# EAGLE design DTUnodeSchematic (EAGLE 8.0.0)
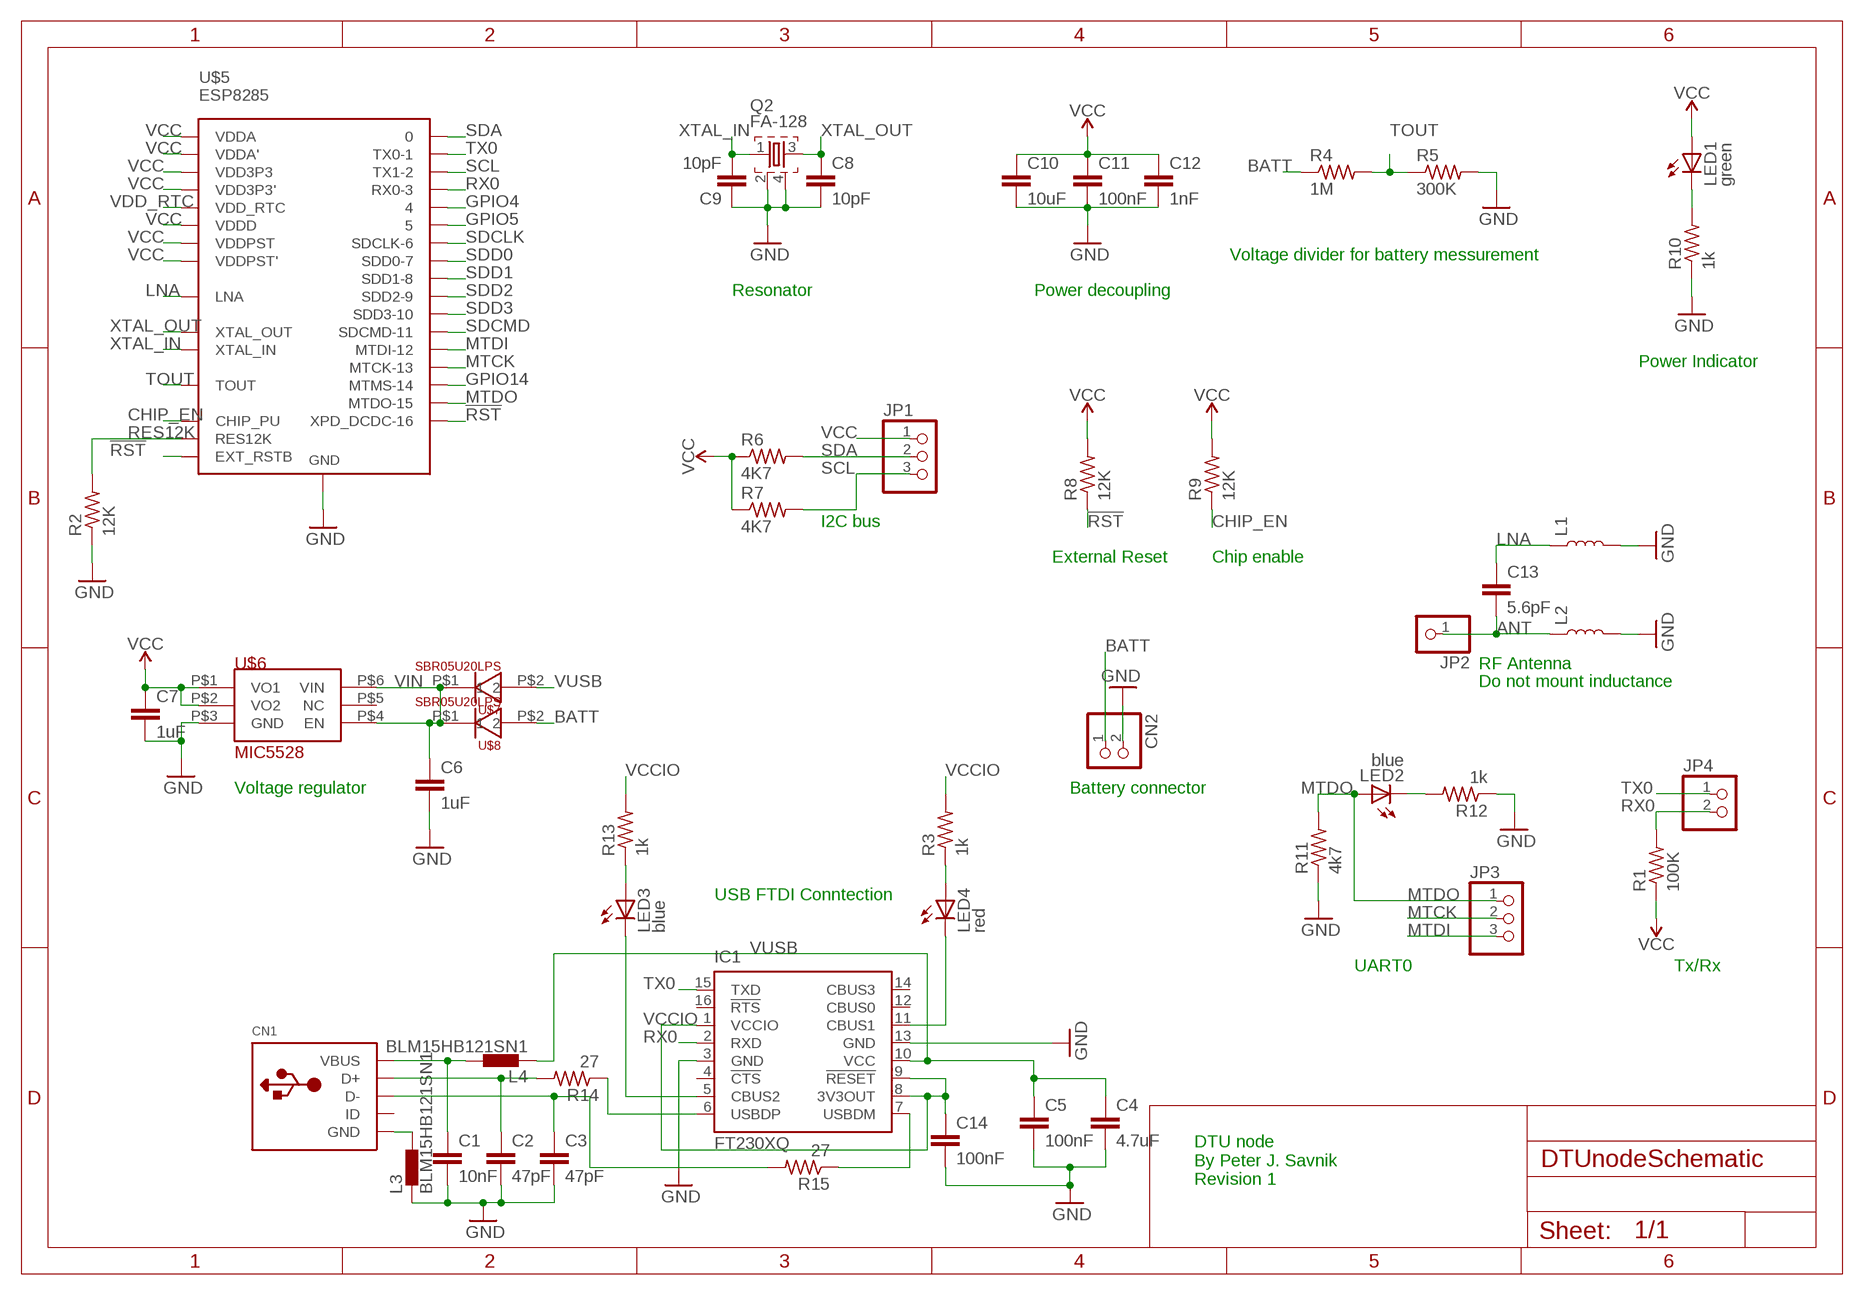
[diagram p0: schematic, sheet 1]

## Parts
C1  10nF  C-EUC0402K  [C0402K]
C2  47pF  C-EUC0402K  [C0402K]
C3  47pF  C-EUC0402K  [C0402K]
C4  4.7uF  C-EUC0402K  [C0402K]
C5  100nF  C-EUC0402K  [C0402K]
C6  1uF  C-EUC0402K  [C0402K]
C7  1uF  C-EUC0402K  [C0402K]
C8  10pF  C-EUC0402K  [C0402K]
C9  10pF  C-EUC0402K  [C0402K]
C10  10uF  C-EUC0402K  [C0402K]
C11  100nF  C-EUC0402K  [C0402K]
C12  1nF  C-EUC0402K  [C0402K]
C13  5.6pF  C-EUC0402K  [C0402K]
C14  100nF  C-EUC0402K  [C0402K]
CN1  USBMINIB  [USB-MINIB]
CN2  JST_2PIN-THM-RA  [JST-PH-2-THM-RA]
IC1  FT230XQ  [QFN16]
JP1  PINHD-1X3  [1X03]
JP2  PINHD-1X1  [1X01]
JP3  PINHD-1X3  [1X03]
JP4  PINHD-1X2  [1X02]
L1  INDUCTOR-0402-3.9NH  [0402]
L2  INDUCTOR-0402-3.9NH  [0402]
L3  BLM15HB121SN1  [0402]
L4  BLM15HB121SN1  [0402]
LED1  green  LEDCHIP-LED0603  [CHIP-LED0603]
LED2  blue  LEDCHIP-LED0603  [CHIP-LED0603]
LED3  blue  LEDCHIP-LED0603  [CHIP-LED0603]
LED4  red  LEDCHIP-LED0603  [CHIP-LED0603]
Q2  FA-128  [FA-128]
R1  100K  R-US_R0402  [R0402]
R2  12K  R-US_R0402  [R0402]
R3  1k  R-US_R0402  [R0402]
R4  1M  R-US_R0402  [R0402]
R5  300K  R-US_R0402  [R0402]
R6  4K7  R-US_R0402  [R0402]
R7  4K7  R-US_R0402  [R0402]
R8  12K  R-US_R0402  [R0402]
R9  12K  R-US_R0402  [R0402]
R10  1k  R-US_R0402  [R0402]
R11  4k7  R-US_R0402  [R0402]
R12  1k  R-US_R0402  [R0402]
R13  1k  R-US_R0402  [R0402]
R14  27  R-US_R0402  [R0402]
R15  27  R-US_R0402  [R0402]
U$5  ESP8285  [QFN-32]
U$6  MIC5528  [6-PIN_1.2MMX1.2MM_THIN_FDN(MT)]
U$7  SBR05U20LPS  [X2-DFN1006-2]
U$8  SBR05U20LPS  [X2-DFN1006-2]

## Nets
!RST: R8.1 U$5.P$8(XPD_DCDC-16) U$5.P$32(EXT_RSTB)
ANT: C13.2 JP2.1 L2.1
BATT: CN2.1 R4.1 U$8.P$2
CHIP_EN: R9.1 U$5.P$7(CHIP_PU)
GND: C1.2 C2.2 C3.2 C4.2 C5.2 C6.2 C7.2 C8.2 C9.1 C10.2 C11.2 C12.2 C14.2 CN2.2 IC1.3(GND) IC1.13(GND) L1.2 L2.2 L3.1 Q2.2 Q2.4 R2.1 R5.2 R10.1 R11.1 R12.1 U$5.33-GND(GND) U$6.P$3(GND)
GPIO4: U$5.P$16
GPIO5: U$5.P$24
GPIO14: U$5.P$9(MTMS-14)
LNA: C13.1 L1.1 U$5.P$2(LNA)
MTCK: JP3.2 U$5.P$12(MTCK-13)
MTDI: JP3.3 U$5.P$10(MTDI-12)
MTDO: JP3.1 LED2.A R11.2 U$5.P$13(MTDO-15)
N$1: CN1.GND L3.2
N$2: IC1.6(USBDP) R14.1
N$4: C1.1 CN1.VBUS L4.2
N$5: C2.1 CN1.D+ R14.2
N$6: LED1.C R10.2
N$7: C3.1 CN1.D- R15.2
N$8: LED2.C R12.2
N$9: IC1.7(USBDM) R15.1
N$16: LED3.A R13.1
N$17: LED4.A R3.1
N$18: IC1.5(CBUS2) LED3.C
N$19: IC1.11(CBUS1) LED4.C
RES12K: R2.2 U$5.P$31(RES12K)
RX0: IC1.2(RXD) JP4.2 R1.2 U$5.P$25(RX0-3)
SCL: JP1.3 R7.2 U$5.P$14(TX1-2)
SDA: JP1.2 R6.2 U$5.P$15
SDCLK: U$5.P$21(SDCLK-6)
SDCMD: U$5.P$20(SDCMD-11)
SDD0: U$5.P$22(SDD0-7)
SDD1: U$5.P$23(SDD1-8)
SDD2: U$5.P$18(SDD2-9)
SDD3: U$5.P$19(SDD3-10)
TOUT: R4.2 R5.1 U$5.P$6(TOUT)
TX0: IC1.15(TXD) JP4.1 U$5.P$26(TX0-1)
VCC: C7.1 C10.1 C11.1 C12.1 JP1.1 LED1.A R1.1 R6.1 R7.1 R8.2 R9.2 U$5.P$1(VDDA) U$5.P$3(VDD3P3) U$5.P$4(VDD3P3') U$5.P$11(VDDPST) U$5.P$17(VDDPST') U$5.P$29(VDDD) U$5.P$30(VDDA') U$6.P$1(VO1) U$6.P$2(VO2)
VCCIO: C14.1 IC1.1(VCCIO) IC1.8(3V3OUT) IC1.9(!RESET) R3.2 R13.2
VDD_RTC: U$5.P$5(VDD_RTC)
VIN: C6.1 U$6.P$4(EN) U$6.P$6(VIN) U$7.P$1 U$8.P$1
VUSB: C4.1 C5.1 IC1.10(VCC) L4.1 U$7.P$2
XTAL_IN: C9.2 Q2.1 U$5.P$28(XTAL_IN)
XTAL_OUT: C8.1 Q2.3 U$5.P$27(XTAL_OUT)
Unconnected: CN1.ID IC1.4(!CTS) IC1.12(CBUS0) IC1.14(CBUS3) IC1.16(!RTS) U$6.P$5(NC)

## Notes on the sheet
- Voltage divider for battery messurement
- Resonator | Power decoupling
- Power Indicator
- I2C bus
- External Reset | Chip enable
- RF Antenna
- Do not mount inductance
- Voltage regulator | Battery connector
- USB FTDI Conntection
- UART0 | Tx/Rx
- DTU node
  By Peter J. Savnik
  Revision 1

## Library data of the parts
C1 = resistor:C-EU: CAPACITOR, European symbol; MF: MULTICOMP; MPN: MC1206B103K102CT; OC_FARNELL: 1855902
C2-C14 = resistor:C-EU: CAPACITOR, European symbol; OC_FARNELL: unknown
CN1 = adafruit:USB: USB Connectors USBMINIB - Surface Mount Female Mini-B USB Connector 4UConnector: 06564 By microbuilder.eu Thru-hole RA Female Mini-B USB Connector 4UConnector: 18732 By ladyada.net; OC_FARNELL: unknown
CN2 = adafruit:JST_2PIN: JST 2-Pin Connectors of various flavors SMT-RA (S2B-PH-SM4) 4UConnector #17311 SMT (B2B-PH-SM4) THM-RA (S2B-PH) THM (B2B-PH); OC_FARNELL: unknown
IC1 = ftdichip:FT230X: USB to BASIC UART IC Auto generated by make-symbol-device-package-bsdl.ulp Rev. 43 Source: Data sheet <http://www.ftdichip.com/Support/Documents/DataSheets/ICs/DS_FT230X.pdf>; OC_FARNELL: unknown
JP1 JP3 = adafruit:PINHD-1X3: PIN HEADER; OC_FARNELL: unknown
JP2 = adafruit:PINHD-1X1: Pin header 1x1 for 0.1" spacing With round pins; OC_FARNELL: unknown
JP4 = pinhead:PINHD-1X2: PIN HEADER; OC_FARNELL: unknown
L1 L2 = SparkFun-Coils:INDUCTOR: Inductors Resist changes in electrical current. Basically a coil of wire. SparkFun Products: SparkFun Load Cell Amplifier - HX711 <https://www.sparkfun.com/products/13879> IOIO-OTG - V2.2 <https://www.sparkfun.com/products/13613>; OC_FARNELL: unknown; PROD_ID: NDUC-13457; VALUE: 3.9NH
L3 L4 = inductors:BLM15H: EMIFIL (R) Chip Ferrite Bead for GHz Noise Source: http://www.murata.com/ Ferrite Bead BLM15H.pdf; OC_FARNELL: unknown
LED1-LED4 = adafruit:LED: LED OSRAM: - CHIPLED LG R971, LG N971, LY N971, LG Q971, LY Q971, LO R971, LY R971 LH N974, LH R974 LS Q976, LO Q976, LY Q976 LO Q996 - Hyper CHIPLED LW Q18S LB Q993, LB Q99A, LB R99A - SideLED LS A670, LO A670, LY A670, LG A670, LP A670 LB A673, LV A673, LT A673, LW A673 LH A674 LY A675 LS A676, LA A676, LO A676, LY A676, LW A676 LS A679, LY A679, LG A679 - Hyper Micro SIDELED® LS Y876, LA Y876, LO Y876, LY Y876 LT Y87S - SmartLED LW L88C, LW L88S LB L89C, LB L89S, LG L890 LS L89K, LO L89K, LY L89K LS L896, LA L896, LO L896, LY L896 - TOPLED LS T670, LO T670, LY T670, LG T670, LP T670 LSG T670, LSP T670, LSY T670, LOP T670, LYG T670 LG T671, LOG T671, LSG T671 LB T673, LV T673, LT T673, LW T673 LH T674 LS T676, LA T676, LO T676, LY T676, LB T676, LH T676, LSB T676, LW T676 LB T67C, LV T67C, LT T67C, LS T67K, LO T67K, LY T67K, LW E67C LS E67B, LA E67B, LO E67B, LY E67B, LB E67C, LV E67C, LT E67C LW T67C LS T679, LY T679, LG T679 LS T770, LO T770, LY T770, LG T770, LP T770 LB T773, LV T773, LT T773, LW T773 LH T774 LS E675, LA E675, LY E675, LS T675 LS T776, LA T776, LO T776, LY T776, LB T776 LHGB T686 LT T68C, LB T68C - Hyper Mini TOPLED® LB M676 - Mini TOPLED Santana® LG M470 LS M47K, LO M47K, LY M47K Source: http://www.osram.convergy.de/; OC_FARNELL: unknown
Q2 = crystal:FA-: MHz RANGE CRYSTAL UNIT Source: Epson Toyocom; OC_FARNELL: unknown
R1-R15 = resistor:R-US_: RESISTOR, American symbol; OC_FARNELL: unknown
U$5 = Ma-ESP8285:ESP8285: ESP8285 Microcontroller with wifi and 1M flash by Espressif; OC_FARNELL: unknown
U$6 = micrel:MIC5528: Microchip Technology MIC5528 500mA High-Performance LDO Microchip MIC5528 500mA High-Performance LDO is a low-power, µCap, low dropout regulator designed for optimal performance in a very small footprint. It is capable of sourcing up to 500mA of output current while only drawing 38µA of operating current. This high-performance LDO is a µCap design in a thermally enhanced 1.2mmx1.2mm extra thin (0.4mm height) DFN package. It operates with small ceramic output capacitor for stability, thereby reducing required board space. Ideal for battery-operated applications, the MIC5528 offers ±2% accuracy, extremely low dropout voltage (260mV @ 500mA), and can regulate output voltage down to 1.0V. Equipped with a TTL logic-compatible enable pin, the MIC5528 can be put into a zero-off-mode current state, drawing no current when disabled.; OC_FARNELL: unknown
U$7 U$8 = Diodes_Inc_By_element14_Batch_1:SBR05U20LPS: SURFACE MOUNT SUPER BARRIER RECTIFIER Ultra-Low Forward Voltage Drop Superior Reverse Avalanche Capability Patented Super Barrier Rectifier Technology Soft, Fast Switching Capability +150°C Operating Junction Temperature Totally Lead-Free & Fully RoHS Compliant (Notes 1 & 2) Halogen and Antimony Free. “Green” Device (Note 3); OC_FARNELL: unknown

## Board
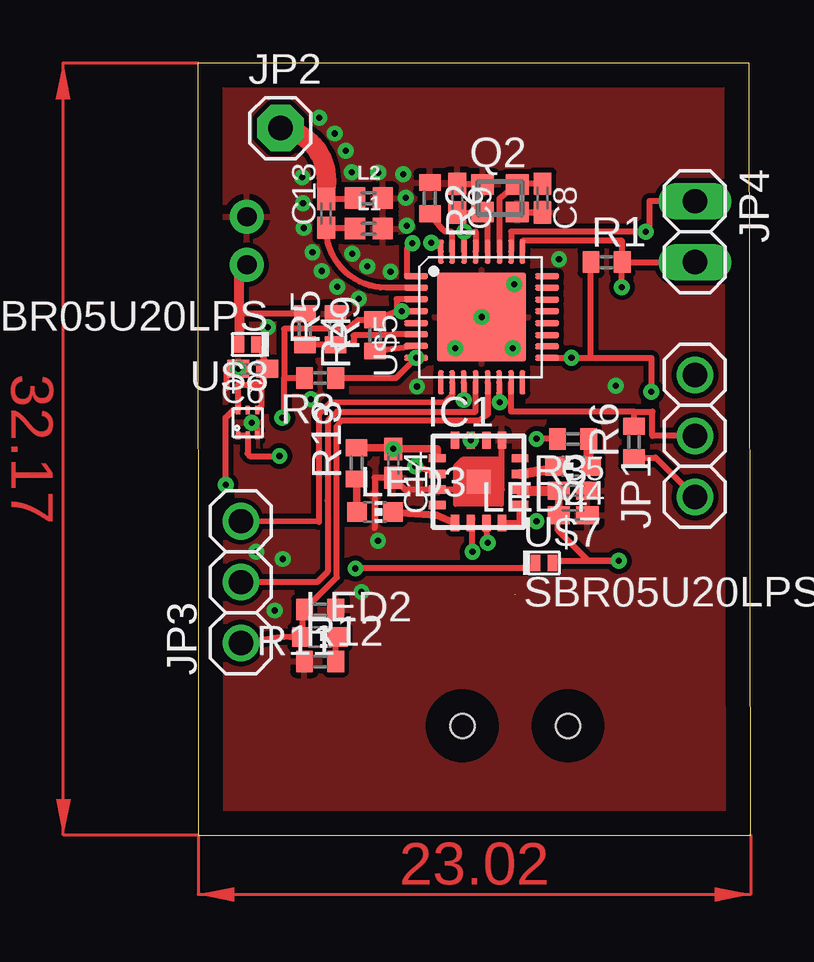
[diagram p1: board, top side]
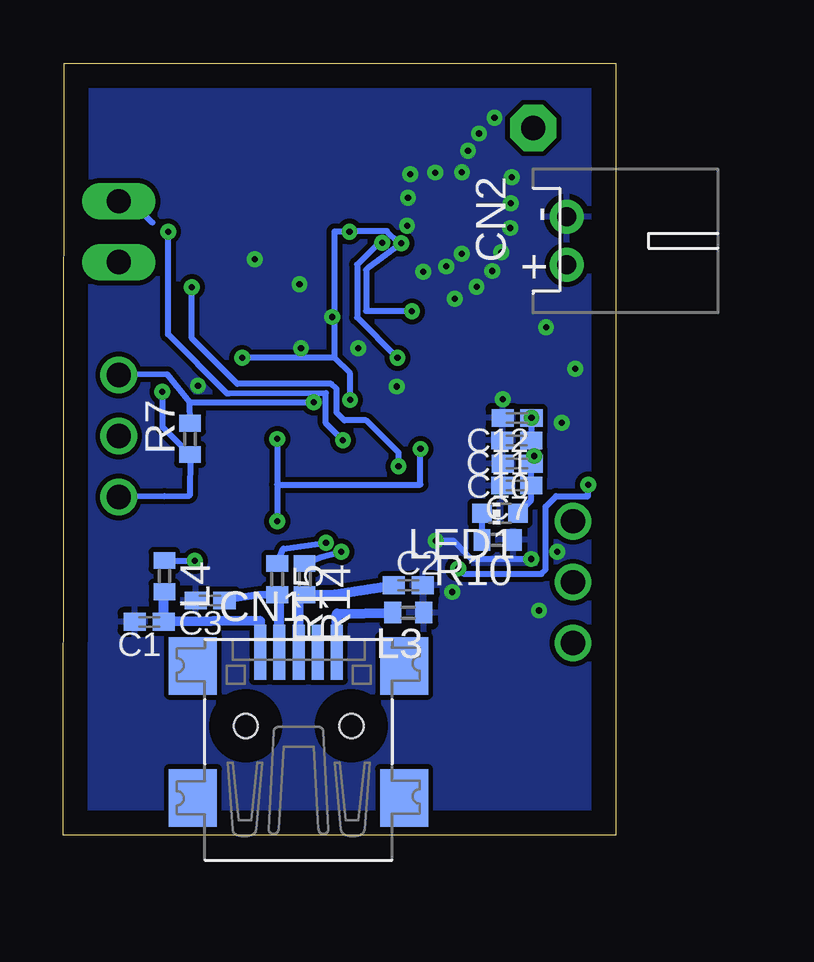
[diagram p2: board, bottom side, seen from below]

Size 23.03 x 32.17 mm. Coordinates in mm from the lower left corner, seen from the top.
Outline: 0.01,0 23.03,0 22.98,32.16 0,32.17 0.01,0
Copper layers (1*16): Top 0.035mm / dielectric 1.5mm / Bottom 0.035mm
Design rules "default": minimum track width 10mil, minimum drill 24mil, track to track 8mil, track to pad 8mil, pad to pad 8mil, via to via 8mil, smd to smd 8mil, copper to edge 40mil, drill to drill 8mil, minimum pad ring 10mil, minimum via ring 8mil, stop-mask expansion 4mil, vias tented up to drill 0mil, thermal gap 10mil

### Footprints (pad centres in the part's own frame; a part is rotated, then mirrored left to right if it is on the bottom)
C0402K = smd 0.925 x 0.74: 1 -0.6,0; 2 0.6,0
USB-MINIB = smd 0.5 x 2.308: D+ 0,4.064; D- -0.8,4.064; GND 1.6,4.064; ID 0.8,4.064; VBUS -1.6,4.064 | smd 2 x 2.4: GND1 -4.4,-2; GND2 -4.4,3.5; GND3 4.4,3.5; GND4 4.4,-2 | hole 1: -2.2,1; 2.2,1
JST-PH-2-THM-RA = drill 0.8 pad 1.422: 1 1,0; 2 -1,0
QFN16 = smd 0.7 x 0.35: 1 -1.725,0.975; 2 -1.725,0.325; 3 -1.725,-0.325; 4 -1.725,-0.975; 9 1.725,-0.975; 10 1.725,-0.325; 11 1.725,0.325; 12 1.725,0.975 | smd 0.35 x 0.7: 5 -0.975,-1.725; 6 -0.325,-1.725; 7 0.325,-1.725; 8 0.975,-1.725; 13 0.975,1.725; 14 0.325,1.725; 15 -0.325,1.725; 16 -0.975,1.725 | smd 1 x 1: TAB 0,0
1X03 = drill 1.016: 1 -2.54,0; 2 0,0; 3 2.54,0
1X01 = drill 1.016 pad 1.93 octagon: 1 0,0
1X02 = drill 1.016 long: 1 -1.27,0; 2 1.27,0
0402 = smd 0.85 x 0.9: 1 -0.58,0; 2 0.58,0
0402' = smd 0.7 x 0.9: 1 -0.65,0; 2 0.65,0
CHIP-LED0603 = smd 0.8 x 0.8: A 0,-0.75; C 0,0.75
FA-128 = smd 0.95 x 0.85: 1 -0.725,-0.575; 2 0.725,-0.575; 3 0.725,0.575; 4 -0.725,0.575
R0402 = smd 0.7 x 0.9: 1 -0.65,0; 2 0.65,0
QFN-32 = smd 3.7 x 3.7: 33-GND 0,0 | smd 0.25 x 1: P$1 1.7,2.725; P$2 1.225,2.725; P$3 0.75,2.725; P$4 0.25,2.725; P$5 -0.25,2.725; P$6 -0.725,2.725; P$7 -1.2,2.725; P$8 -1.7,2.725; P$17 -1.7,-2.725; P$18 -1.225,-2.725; P$19 -0.75,-2.725; P$20 -0.25,-2.725; P$21 0.25,-2.725; P$22 0.725,-2.725; P$23 1.225,-2.725; P$24 1.7,-2.725 | smd 1 x 0.25: P$9 -2.725,1.7; P$10 -2.725,1.225; P$11 -2.725,0.75; P$12 -2.725,0.25; P$13 -2.725,-0.25; P$14 -2.725,-0.725; P$15 -2.725,-1.225; P$16 -2.725,-1.7; P$25 2.725,-1.7; P$26 2.725,-1.225; P$27 2.725,-0.75; P$28 2.725,-0.25; P$29 2.725,0.25; P$30 2.725,0.725; P$31 2.725,1.225; P$32 2.725,1.7
6-PIN_1.2MMX1.2MM_THIN_FDN(MT) = smd 0.18 x 0.35: P$1 0,0; P$2 0.4,0; P$3 0.8,0; P$4 0,1.05; P$5 0.4,1.05; P$6 0.8,1.05
X2-DFN1006-2 = smd 0.4 x 0.7: P$1 0,0; P$2 0.7,0

### Placement (x,y rotation side)
C1  19.44,8.89 180 bottom
C2  8.65,10.41 0 bottom
C3  16.9,9.78 180 bottom
C4  15.63,13.34 0 top
C5  15.63,14.35 0 top
C6  2.29,19.43 180 top
C7  4.13,14.57 180 bottom
C8  14.36,26.54 270 top
C9  10.81,26.54 270 top
C10  4.11,15.48 180 bottom
C11  4.13,16.45 180 bottom
C12  4.11,17.39 180 bottom
C13  5.35,25.91 90 top
C14  8.14,15.49 270 top
CN1  13.22,3.56 0 bottom
CN2  2.04,24.77 270 bottom
IC1  11.7,14.73 0 top
JP1  20.71,16.64 90 top
JP2  3.44,29.46 0 top
JP3  1.79,10.54 90 top
JP4  20.71,25.15 270 top
L1  7.12,25.27 0 top
L2  7.12,26.54 0 top
L3  BLM15HB121SN1  [0402']  8.65,9.27 180 bottom
L4  BLM15HB121SN1  [0402']  18.81,10.79 270 bottom
LED1  4.83,13.41 90 bottom
LED2  5.09,8.26 270 top
LED3  7.38,13.46 270 top
LED4  15.63,15.37 90 top
Q2  12.59,26.54 0 top
R1  17.03,23.88 0 top
R2  9.66,26.54 270 top
R3  15.63,16.51 180 top
R4  4.46,21.08 270 top
R5  5.73,21.08 90 top
R6  18.17,16.38 90 top
R7  17.74,16.51 90 bottom
R8  5.09,19.05 180 top
R9  7.38,20.83 90 top
R10  4.93,12.31 180 bottom
R11  5.09,9.4 180 top
R12  5.09,7.24 0 top
R13  6.62,15.49 90 top
R14  12.97,10.67 270 bottom
R15  14.11,10.67 270 bottom
U$5  11.82,21.59 90 top
U$6  1.68,16.66 0 top
U$7  14.07,11.34 0 top
U$8  2.43,20.45 180 top

### Tracks (layer width: path | path; a pad name or v marks a point on that pad's centre or on a via)
!RST  (via drill 0.25 pad 0.25)
  Top 0.254: R8.1 8.26,19.05 U$5.P$8 | U$5.P$32 10.12,24.69 v9.73,24.69
  Bottom 0.254: v9.73,24.69 9.87,24.69 10.78,23.77 10.78,21.57 U$5.P$8
  other vias: 9.1,19.89
ANT
  Top 0.254: 5.35,27.05 C13.2 6.51,26.51 arc90 L2.1
  Top 0.813: 5.35,27.05 arc90 JP2.1
BATT
  Top 0.254: R4.1 1.73,21.73 1.73,21.59
  Top 0.406: CN2.1 1.73,23.77 1.73,21.59 U$8.P$2
CHIP_EN
  Top 0.254: R9.1 U$5.P$7
GND  (via drill 0.25 pad 0.25)
  Top 0.254: C9.1 11.84,27.14 arc-90 Q2.4 | C8.2 13.34,25.94 arc-90 Q2.2 | IC1.13 12.67,14.41 IC1.3 8.63,14.41 C14.2 7.37,14.89 7.37,12.79 | C6.2 1.18,19.43 1.18,18.62 | U$5.33-GND 10.73,21.59 v10.73,20.28 | v2.25,17.18 2.48,16.95 U$6.P$3
  Bottom 0.254: v3.53,11.51 6.02,11.51 6.78,12.27 v7.51,12.27
  other vias: 15.05,24 9.13,18.69 11.82,21.59 13.12,20.29 13.18,22.96 2.44,11.81 3.2,9.36 2.91,21.16 8.7,25.4 8.66,26.56 8.56,27.53 7.52,27.61 6.41,27.62 8.03,23.48 7.06,23.7 6.43,24.23 6.71,22.35 5.8,22.85 5.16,23.51 4.78,24.3 4.41,25.3 4.38,26.33 4.34,27.42 6.16,28.51 5.7,29.24 5.05,29.9 1.69,19.43 17.41,18.72 4.71,18.16 6.82,10.13
  pour Bottom: -0.77,33.19 26.12,33.19 26.12,-1.57 -0.77,-1.57
  pour Top: -1.8,34.43 27.75,34.43 27.75,-2.17 -1.8,-2.17
LNA
  Top 0.254: U$5.P$2 7.84,22.82 arc-90 C13.1 6.51,25.31 arc-90 L1.1
MTCK
  Top 0.254: 2.04,10.54 JP3.2 4.98,10.54 5.41,10.97 5.41,13.95 5.42,17.27 5.8,17.65 11.57,17.65 U$5.P$12
MTDI
  Top 0.254: U$5.P$10 10.6,18.33 10.3,18.03 5.51,18.01 5.04,17.54 5.04,13.07 | 5.04,13.06 5.04,13.07 | 5.04,13.07 JP3.3
MTDO
  Top 0.254: U$5.P$13 12.07,17.52 11.7,17.27 5.98,17.27 5.79,17.06 5.79,10.75 R11.2 4.34,9.4 LED2.A 3.82,8.26 3.58,8.27 JP3.1
N$1
  Bottom 0.406: 11.58,7.62 CN1.GND 11.62,9.23 L3.2
N$2  (via drill 0.25 pad 0.25)
  Top 0.254: v11.44,11.81 11.44,13.19 IC1.6
  Bottom 0.254: R14.1 12.32,11.57 v11.44,11.81
N$4
  Bottom 0.406: 14.86,7.62 CN1.VBUS 14.82,8.93 C1.1 18.84,9.83 L4.2
N$5  (1 unrouted)
  Bottom 0.406: 13.22,10.03 12.84,10.03 | CN1.D+ 13.22,10.02 R14.2 12.85,10.02 11.7,10.03 C2.1
N$6
  Bottom 0.254: LED1.C R10.2
N$7
  Bottom 0.305: R15.2 14.87,10.02 15.89,9.87 C3.1
  Bottom 0.406: CN1.D- 14.02,10.18 R15.2
N$8
  Top 0.254: R12.2 5.74,8.15 LED2.C
N$9  (via drill 0.25 pad 0.25)
  Top 0.254: v12.08,12.19 IC1.7
  Bottom 0.254: R15.1 13.86,11.94 v12.08,12.19
N$16
  Top 0.305: R13.1 6.63,14.84 LED3.A
N$17
  Top 0.406: LED4.A 16.28,15.62 R3.1
N$18
  Top 0.305: LED3.C 9.96,13.34 IC1.5
N$19
  Top 0.406: IC1.11 14.56,15.23 LED4.C
RES12K
  Top 0.254: U$5.P$31 10.6,25.1 10.55,25.15 10.3,25.15 10.17,25.27 R2.2
RX0  (via drill 0.25 pad 0.25)
  Top 0.254: R1.2 17.68,24.77 13.52,24.77 U$5.P$25 | R1.2 JP4.2 | IC1.2 v9.05,15.37 | v17.67,22.84 17.67,23.86 R1.2
  Bottom 0.254: v9.05,15.37 9.05,15.94 10.4,17.29 11.32,17.29 11.63,17.6 11.63,18.59 11.85,18.81 15.77,18.81 17.67,20.7 v17.67,22.84
SCL  (via drill 0.25 pad 0.25)
  Top 0.254: U$5.P$14 12.55,17.94 v12.59,18.03
  Bottom 0.254: 17.75,18.05 v12.59,18.03 | 17.75,18.05 18.68,19.2 JP1.3 | R7.2 17.75,18.05
SDA
  Top 0.254: JP1.2 18.94,16.64 18.94,17.65 18.17,17.65 | 18.17,17.65 13.05,17.65 U$5.P$15 | R6.2 18.17,17.65
TOUT
  Top 0.254: R4.2 R5.1 5.73,20.45 6.49,20.45 6.49,20.83 8.14,20.83 8.14,20.86 U$5.P$6
TX0  (via drill 0.25 pad 0.25)
  Top 0.254: U$5.P$26 13.05,25.15 v18.66,25.15 18.81,25.15 18.81,26.42 JP4.1
  Bottom 0.254: IC1.15 12.08,17.16 12.08,18.41 16.13,18.4 16.19,18.4 18.66,20.87 v18.66,25.15 | 19.32,25.53 20.21,26.42 JP4.1
  other vias: 11.37,16.46
VCC  (via drill 0.25 pad 0.25)
  Top 0.254: U$5.P$30 v11.1,25.15 11.57,25.15 U$5.P$29 | 8.28,21.82 R9.2 7.35,21.45 6.64,21.45 6.25,21.09 3.59,21.09 3.59,19.05 | 8.28,21.82 v8.5,21.82 U$5.P$4 | U$5.P$3 8.28,22.34 8.28,21.82 | R6.1 19.08,15.73 JP1.1 | U$5.P$17 v15.57,19.89 | v15.57,19.89 16.38,19.89 R1.1 | U$5.P$1 8.72,23.29 8.72,24.45 v8.94,24.66 | 3.59,19.05 R8.2 | U$6.P$1 U$6.P$2 2.07,15.9 2.17,15.8 v3.4,15.8 | C12.1 3.59,17.47 3.59,19.05 | U$5.P$11 v11.07,18.14 | v15.57,19.89 18.9,19.89 v18.9,18.48
  Bottom 0.254: JP1.1 18.81,14.13 17.76,14.15 R7.1 18.9,17.02 v18.9,18.48 18.81,18.48 | 10.97,25.27 v11.1,25.15 | v8.5,21.82 8.52,21.85 10.4,21.85 10.4,21.84 10.4,23.56 10.32,23.64 v8.94,24.66 9.03,24.66 9.54,25.17 11.07,25.17 v11.1,25.15 | v11.1,25.15 11.06,25.15 | C10.1 3.53,15.49 C11.1 3.53,17.37 C12.1 | C10.1 3.4,15.59 v3.4,15.8 | C10.1 C7.1 3.53,13.96 LED1.A | v11.07,18.14 11.07,19.24 11.72,19.89 | 11.72,19.89 v15.57,19.89 | v11.1,25.15 11.72,25.15 11.72,19.89
  other vias: 3.51,17.39
VCCIO  (via drill 0.25 pad 0.25)
  Top 0.254: IC1.8 13.42,13.01 13.42,13.08 | 13.42,13.08 IC1.9 | R3.2 v14.11,16.51 | v14.11,13.08 13.42,13.08
  Top 0.305: IC1.1 9.97,16.09 C14.1 8.14,16.14 R13.2
  Bottom 0.254: v14.11,16.51 14.11,14.61 | 14.11,14.61 v14.11,13.08 | 14.11,14.61 8.14,14.61 C14.1
  other vias: 8.14,16.09
VIN  (via drill 0.25 pad 0.25)
  Top 0.254: U$8.P$1 2.64,20.23 C6.1 2.64,18.77 | U$6.P$6 2.64,17.88 2.64,18.77 | 2.64,18.77 1.68,18.77 U$6.P$4 1.47,17.71 1.16,17.4 v1.16,14.61 | U$7.P$1 13.84,11.11 v6.57,11.11
  Bottom 0.254: v6.57,11.11 6.34,10.88 3.1,10.88 2.92,11.06 2.92,13.69 2.49,14.12 1.16,14.12 v1.16,14.61
VUSB  (via drill 0.25 pad 0.25)
  Top 0.254: C4.1 15,13.3 15,12.7 16.27,11.43 v17.54,11.43 14.86,11.43 U$7.P$2
  Top 0.305: 13.42,14.35 IC1.10 | C4.1 C5.1
  Top 0.406: 13.42,14.35 C5.1
  Bottom 0.254: L4.1 17.55,11.45 v17.54,11.43
XTAL_IN
  Top 0.254: U$5.P$28 12.07,25.75 Q2.1 arc-90 11.84,25.94 C9.2
XTAL_OUT
  Top 0.254: U$5.P$27 12.57,26.53 12.59,26.54 Q2.3 arc-90 13.34,27.14 C8.1
(copper drawn outside any net)
  shapes: Top area x2